# Altium schematic sheet cap-touch.SchDoc
size A; SheetNumber: 4; SheetTotal: 4
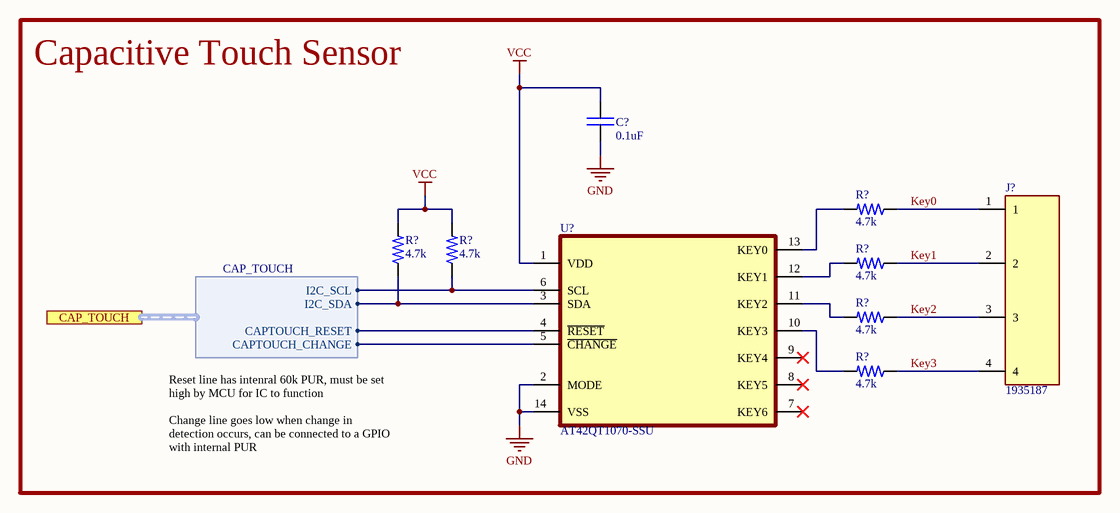
[diagram p0: cap-touch.SchDoc]

## Parts
(Parts that share a designator on the sheet are numbered #1, #2 ... from top to bottom, then left to right.)
C?  value 0.1uF  [0402C]  (hidden comment: CAP)
J?  1935187  [1935187]
R?#1  value 4.7k  [0402R]  (hidden comment: RES)
R?#2  value 4.7k  [0402R]  (hidden comment: RES)
R?#3  value 4.7k  [0402R]  (hidden comment: RES)
R?#4  value 4.7k  [0402R]  (hidden comment: RES)
R?#5  value 4.7k  [0402R]  (hidden comment: RES)
R?#6  value 4.7k  [0402R]  (hidden comment: RES)
U?  AT42QT1070-SSU  [14-SOIC]

## Blocks framed on the sheet
Capacitive Touch Sensor: C? J? R?#1-R?#6 U?

## Ports
CAP_TOUCH (harness CAP_TOUCH)

## Harnesses
CAP_TOUCH: I2C_SCL, I2C_SDA, CAPTOUCH_RESET, CAPTOUCH_CHANGE

## Nets
GND: C?.1 U?.2(MODE) U?.14(VSS)
VCC: C?.2 R?#2.2 R?#3.2 U?.1(VDD)
Key0: J?.1 R?#1.1
Key1: J?.2 R?#4.1
Key2: J?.3 R?#5.1
Key3: J?.4 R?#6.1
NetR?#1_2: R?#1.2 U?.13(KEY0)
NetR?#2_1: R?#2.1 U?.3(SDA) ; port CAP_TOUCH.I2C_SDA
NetR?#3_1: R?#3.1 U?.6(SCL) ; port CAP_TOUCH.I2C_SCL
NetR?#4_2: R?#4.2 U?.12(KEY1)
NetR?#5_2: R?#5.2 U?.11(KEY2)
NetR?#6_2: R?#6.2 U?.10(KEY3)
NetU?_4: U?.4(~{RESET}) ; port CAP_TOUCH.CAPTOUCH_RESET
NetU?_5: U?.5(~{CHANGE}) ; port CAP_TOUCH.CAPTOUCH_CHANGE

Not connected (* = marked no-connect by the designer): U? 7(KEY6)* 8(KEY5)* 9(KEY4)*

## Notes on the sheet
- Reset line has intenral 60k PUR, must be set high by MCU for IC to function
  Change line goes low when change in detection occurs, can be connected to a GPIO with internal PUR

## Library data of the parts
C? = CAP: Capacitor; Type: SMD; MFR: *; MFR PN: *; Vendor: *; Vendor PN: *; Vendor Link: *
J? = SCREW CONN 4 POS: Fixed Terminal Blocks PT 1.5/4-5.0-H; MFR: Phoenix Contact; MFR PN: 1935187; Type: TH
R?#1-R?#6 = RES: Resistor; MFR PN: *; MFR: *; Vendor: *; Vendor PN: *; Vendor Link: *
U? = AT42QT1070-SSU: Capacitive Touch Buttons 14-SOIC; MFR: Microchip; Value: *; MFR PN: AT42QT1070-SSU; Type: SMD